# EAGLE design LCC OpenLCB BoosterPack Base (EAGLE 7.5.0)
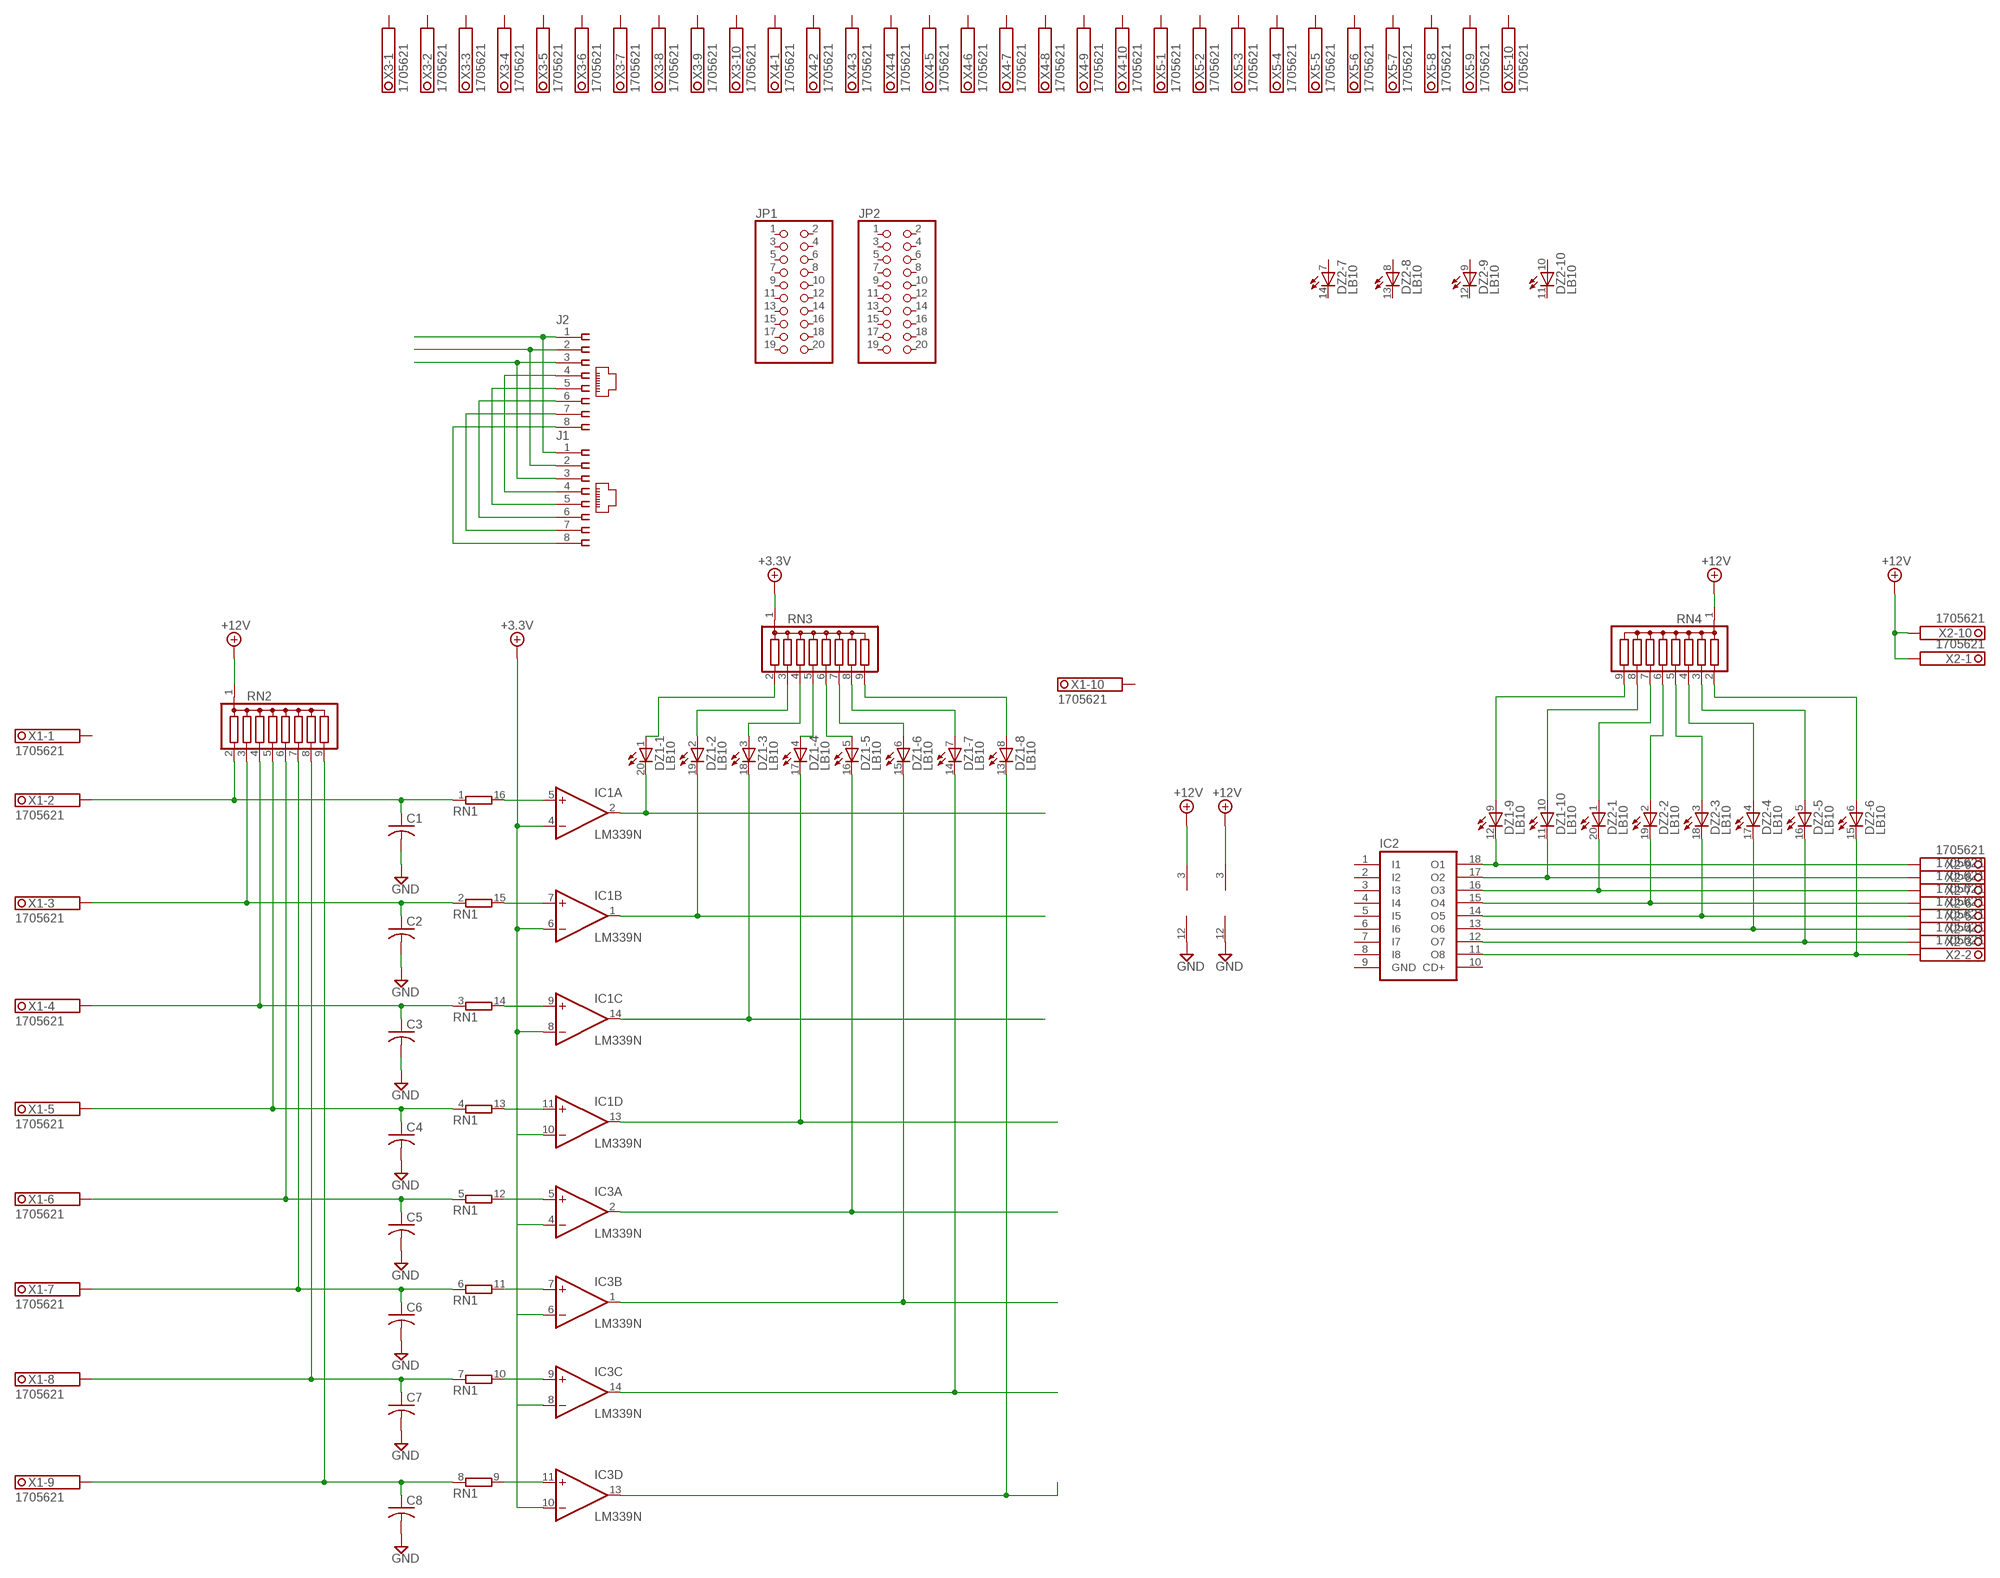
[diagram p0: schematic, sheet 1]

## Parts
C1  C-US075-032X103  [C075-032X103]
C2  C-US075-032X103  [C075-032X103]
C3  C-US075-032X103  [C075-032X103]
C4  C-US075-032X103  [C075-032X103]
C5  C-US075-032X103  [C075-032X103]
C6  C-US075-032X103  [C075-032X103]
C7  C-US075-032X103  [C075-032X103]
C8  C-US075-032X103  [C075-032X103]
DZ1  LB10  [LB10]
DZ2  LB10  [LB10]
IC1  LM339N  [DIL14]
IC2  ULN2803A  [DIL18]
IC3  LM339N  [DIL14]
J1  555164-1  [555164-1]
J2  555164-1  [555164-1]
JP1  PINHD-2X10  [2X10]
JP2  PINHD-2X10  [2X10]
RN1  8R-P  [DIL16]
RN2  G08R  [SIL9]
RN3  G08R  [SIL9]
RN4  G08R  [SIL9]
X1  1705621  [1705621]
X2  1705621  [1705621]
X3  1705621  [1705621]
X4  1705621  [1705621]
X5  1705621  [1705621]

## Nets
+3.3V: IC1.4(A:-IN) IC1.6(B:-IN) IC1.8(C:-IN) IC1.10(D:-IN) IC3.4(A:-IN) IC3.6(B:-IN) IC3.8(C:-IN) IC3.10(D:-IN) RN3.1
+12V: IC1.3(P:V+) IC3.3(P:V+) RN2.1 RN4.1 X2.1.1 X2.1.2 X2.10.1 X2.10.2
GND: C1.2 C2.2 C3.2 C4.2 C5.2 C6.2 C7.2 C8.2 IC1.12(P:GND) IC3.12(P:GND)
N$1: J1.1 J2.1
N$2: J1.2 J2.2
N$3: J1.3 J2.3
N$4: J1.4 J2.4
N$5: J1.5 J2.5
N$6: J1.6 J2.6
N$7: J1.7 J2.7
N$8: J1.8 J2.8
N$9: IC1.5(A:+IN) RN1.16
N$10: IC1.7(B:+IN) RN1.15
N$11: IC1.9(C:+IN) RN1.14
N$12: IC1.11(D:+IN) RN1.13
N$13: DZ1.1(-1:A) RN3.2
N$14: DZ1.2(-2:A) RN3.3
N$15: DZ1.3(-3:A) RN3.4
N$16: DZ1.4(-4:A) RN3.5
N$17: DZ1.5(-5:A) RN3.6
N$18: DZ1.6(-6:A) RN3.7
N$19: DZ1.7(-7:A) RN3.8
N$20: DZ1.8(-8:A) RN3.9
N$21: DZ1.20(-1:C) IC1.2(A:OUT)
N$22: DZ1.19(-2:C) IC1.1(B:OUT)
N$23: DZ1.18(-3:C) IC1.14(C:OUT)
N$24: DZ1.17(-4:C) IC1.13(D:OUT)
N$25: C1.1 RN1.1 RN2.2 X1.2.1 X1.2.2
N$26: C2.1 RN1.2 RN2.3 X1.3.1 X1.3.2
N$27: C3.1 RN1.3 RN2.4 X1.4.1 X1.4.2
N$28: C4.1 RN1.4 RN2.5 X1.5.1 X1.5.2
N$29: IC3.5(A:+IN) RN1.12
N$30: IC3.7(B:+IN) RN1.11
N$31: IC3.9(C:+IN) RN1.10
N$32: IC3.11(D:+IN) RN1.9
N$33: C5.1 RN1.5 RN2.6 X1.6.1 X1.6.2
N$34: C6.1 RN1.6 RN2.7 X1.7.1 X1.7.2
N$35: C7.1 RN1.7 RN2.8 X1.8.1 X1.8.2
N$36: C8.1 RN1.8 RN2.9 X1.9.1 X1.9.2
N$37: DZ1.16(-5:C) IC3.2(A:OUT)
N$38: DZ1.15(-6:C) IC3.1(B:OUT)
N$39: DZ1.14(-7:C) IC3.14(C:OUT)
N$40: DZ1.13(-8:C) IC3.13(D:OUT)
N$42: DZ1.12(-9:C) IC2.18(O1) X2.9.1 X2.9.2
N$43: DZ1.9(-9:A) RN4.9
N$44: DZ1.10(-10:A) RN4.8
N$45: DZ2.1(-1:A) RN4.7
N$46: DZ2.2(-2:A) RN4.6
N$47: DZ2.3(-3:A) RN4.5
N$48: DZ2.4(-4:A) RN4.4
N$49: DZ2.5(-5:A) RN4.3
N$50: DZ2.6(-6:A) RN4.2
N$51: DZ1.11(-10:C) IC2.17(O2) X2.8.1 X2.8.2
N$52: DZ2.20(-1:C) IC2.16(O3) X2.7.1 X2.7.2
N$53: DZ2.19(-2:C) IC2.15(O4) X2.6.1 X2.6.2
N$54: DZ2.18(-3:C) IC2.14(O5) X2.5.1 X2.5.2
N$55: DZ2.17(-4:C) IC2.13(O6) X2.4.1 X2.4.2
N$56: DZ2.16(-5:C) IC2.12(O7) X2.3.1 X2.3.2
N$57: DZ2.15(-6:C) IC2.11(O8) X2.2.1 X2.2.2
Unconnected: DZ2.7(-7:A) DZ2.8(-8:A) DZ2.9(-9:A) DZ2.10(-10:A) DZ2.11(-10:C) DZ2.12(-9:C) DZ2.13(-8:C) DZ2.14(-7:C) IC2.1(I1) IC2.2(I2) IC2.3(I3) IC2.4(I4) IC2.5(I5) IC2.6(I6) IC2.7(I7) IC2.8(I8) IC2.10(CD+) JP1.1 JP1.2 JP1.3 JP1.4 JP1.5 JP1.6 JP1.7 JP1.8 JP1.9 JP1.10 JP1.11 JP1.12 JP1.13 JP1.14 JP1.15 JP1.16 JP1.17 JP1.18 JP1.19 JP1.20 JP2.1 JP2.2 JP2.3 JP2.4 JP2.5 JP2.6 JP2.7 JP2.8 JP2.9 JP2.10 JP2.11 JP2.12 JP2.13 JP2.14 JP2.15 JP2.16 JP2.17 JP2.18 JP2.19 JP2.20 X1.1.1 X1.1.2 X1.10.1 X1.10.2 X3.1.1 X3.1.2 X3.2.1 X3.2.2 X3.3.1 X3.3.2 X3.4.1 X3.4.2 X3.5.1 X3.5.2 X3.6.1 X3.6.2 X3.7.1 X3.7.2 X3.8.1 X3.8.2 X3.9.1 X3.9.2 X3.10.1 X3.10.2 X4.1.1 X4.1.2 X4.2.1 X4.2.2 X4.3.1 X4.3.2 X4.4.1 X4.4.2 X4.5.1 X4.5.2 X4.6.1 X4.6.2 X4.7.1 X4.7.2 X4.8.1 X4.8.2 X4.9.1 X4.9.2 X4.10.1 X4.10.2 X5.1.1 X5.1.2 X5.2.1 X5.2.2 X5.3.1 X5.3.2 X5.4.1 X5.4.2 X5.5.1 X5.5.2 X5.6.1 X5.6.2 X5.7.1 X5.7.2 X5.8.1 X5.8.2 X5.9.1 X5.9.2 X5.10.1 X5.10.2

## Power pins joined to a net without a drawn wire
GND: IC2.9(GND)

## Library data of the parts
C1-C8 = rcl:C-US: CAPACITOR, American symbol
DZ1 DZ2 = led:LB10: LED BLOCK 10-LED bar graph, DIL, Siemens
IC1 IC3 = linear:LM339: Low Power Low Offset Voltage Quad Comparators with open collector; LM139/LM239/LM339/LM2901/LM3302
IC2 = uln-udn:ULN2803A: DRIVER ARRAY
J1 J2 = con-amp:555164-1: AMP connector
JP1 JP2 = pinhead:PINHD-2X10: PIN HEADER
RN1 = resistor-dil:8R-P: DIL RESISTOR; OC_FARNELL: unknown; OC_NEWARK: unknown
RN2-RN4 = resistor-sil:G08R: SIL RESISTOR; OC_FARNELL: unknown; OC_NEWARK: unknown
X1-X5 = con-phoenix-3.81:1705621: MKDSD 1,5/10-3,81 Printklemme Nennstrom: 8 A Bemessungsspannung: 200 V Raster: 3,81 mm Polzahl: 12 Montageart: Löten Anschlussart: Schraubanschluss Anschlussrichtung vom Leiter zur Platine: 0° Source: http://eshop.phoenixcontact.com .. 1705621.pdf; OC_FARNELL: unknown; OC_NEWARK: unknown

## Board
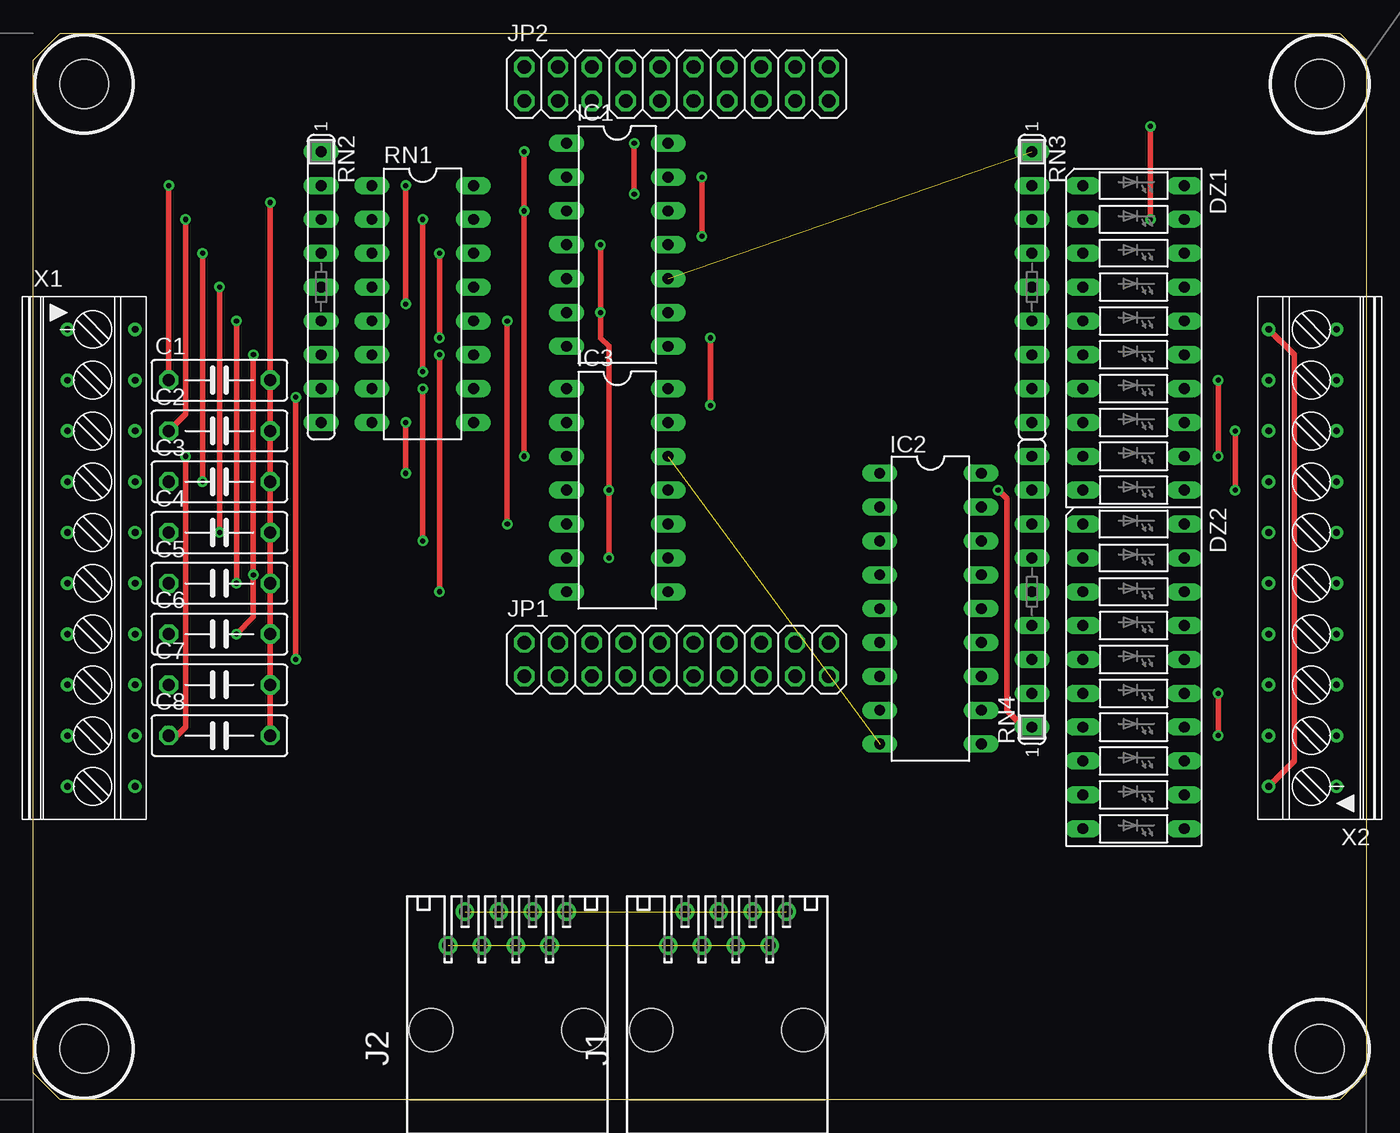
[diagram p1: board, top side]
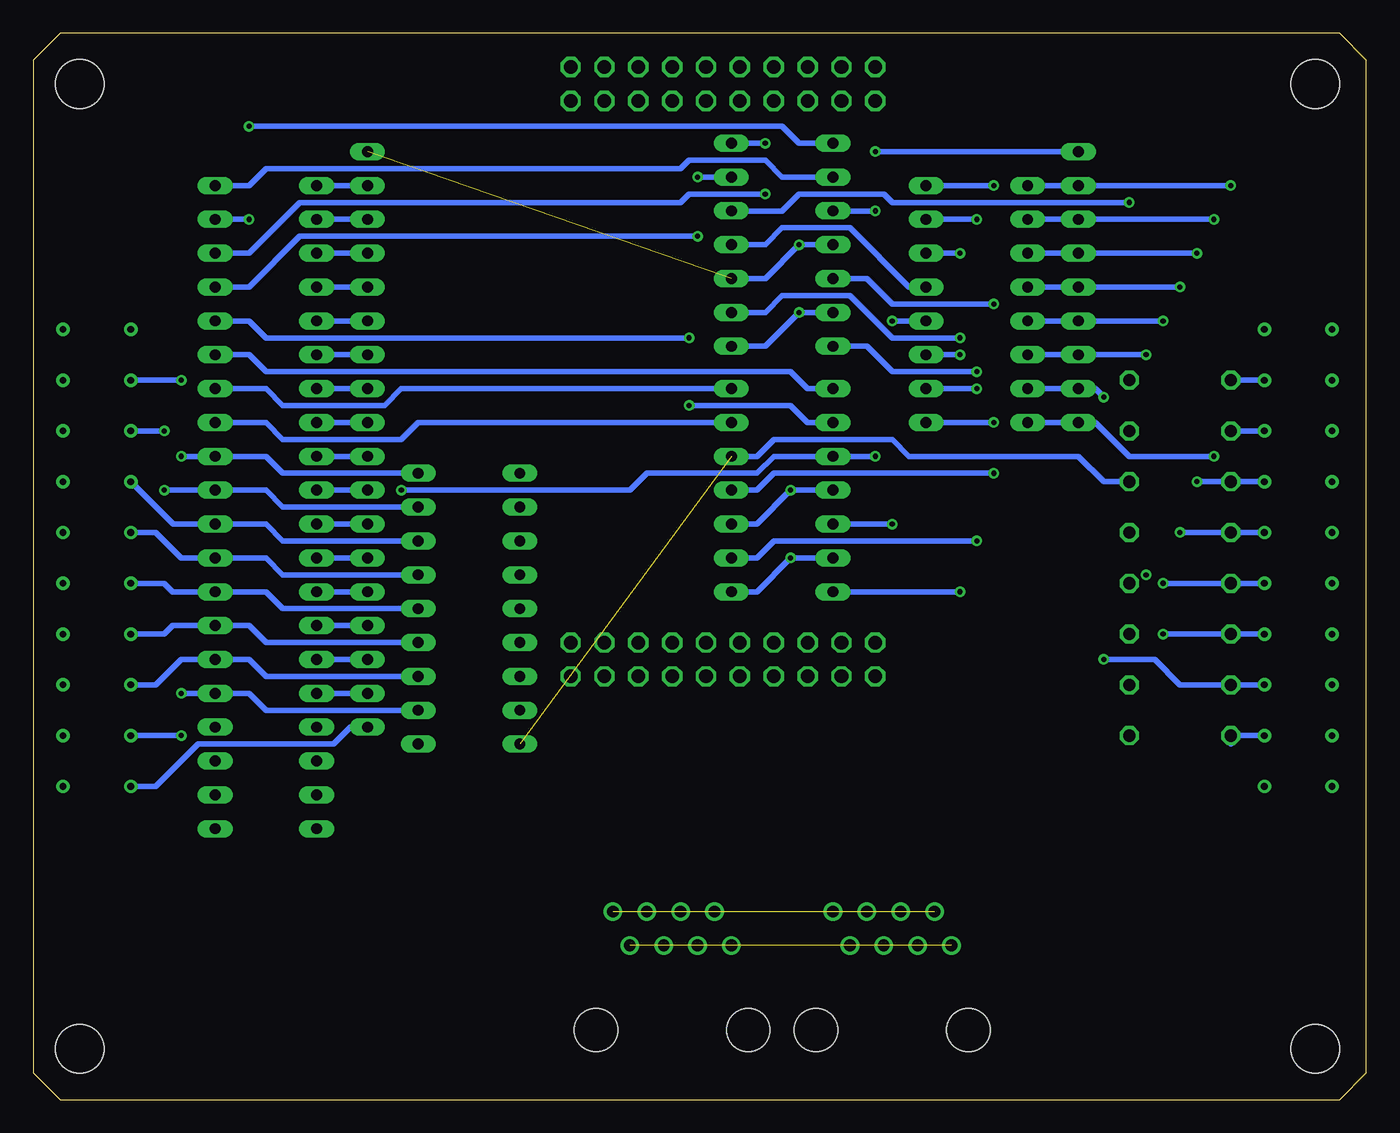
[diagram p2: board, bottom side, seen from below]

Size 100 x 80 mm. Coordinates in mm from the lower left corner, seen from the top.
Outline: 98,0 2,0 0,2 0,78 2,80 98,80 100,78 100,2 98,0
Copper layers (1*16): Top 0.035mm / dielectric 1.5mm / Bottom 0.035mm
Design rules "default": minimum track width 10mil, minimum drill 24mil, track to track 8mil, track to pad 8mil, pad to pad 8mil, via to via 8mil, smd to smd 8mil, copper to edge 40mil, drill to drill 8mil, minimum pad ring 10mil, minimum via ring 8mil, stop-mask expansion 4mil, vias tented up to drill 0mil, thermal gap 10mil
Holes 3.66 mm at 3.81,76.2 96.52,76.2 96.52,3.81 3.81,3.81 3.81,76.2
tKeepout: area 0.4,72.8 to 7.2,79.6; area 93.1,72.8 to 99.9,79.6; area 93.1,0.4 to 99.9,7.2; area 0.4,0.4 to 7.2,7.2
bKeepout: area 0.4,72.8 to 7.2,79.6; area 93.1,72.8 to 99.9,79.6; area 93.1,0.4 to 99.9,7.2; area 0.4,0.4 to 7.2,7.2

### Footprints (pad centres in the part's own frame; a part is rotated, then mirrored left to right if it is on the bottom)
C075-032X103 = drill 0.914 octagon: 1 -3.81,0; 2 3.81,0
LB10 = drill 0.813 long: 1 -11.43,-3.81; 2 -8.89,-3.81; 3 -6.35,-3.81; 4 -3.81,-3.81; 5 -1.27,-3.81; 6 1.27,-3.81; 7 3.81,-3.81; 8 6.35,-3.81; 9 8.89,-3.81; 10 11.43,-3.81; 11 11.43,3.81; 12 8.89,3.81; 13 6.35,3.81; 14 3.81,3.81; 15 1.27,3.81; 16 -1.27,3.81; 17 -3.81,3.81; 18 -6.35,3.81; 19 -8.89,3.81; 20 -11.43,3.81
DIL14 = drill 0.813 long: 1 -7.62,-3.81; 2 -5.08,-3.81; 3 -2.54,-3.81; 4 0,-3.81; 5 2.54,-3.81; 6 5.08,-3.81; 7 7.62,-3.81; 8 7.62,3.81; 9 5.08,3.81; 10 2.54,3.81; 11 0,3.81; 12 -2.54,3.81; 13 -5.08,3.81; 14 -7.62,3.81
DIL18 = drill 0.813 long: 1 -10.16,-3.81; 2 -7.62,-3.81; 3 -5.08,-3.81; 4 -2.54,-3.81; 5 0,-3.81; 6 2.54,-3.81; 7 5.08,-3.81; 8 7.62,-3.81; 9 10.16,-3.81; 10 10.16,3.81; 11 7.62,3.81; 12 5.08,3.81; 13 2.54,3.81; 14 0,3.81; 15 -2.54,3.81; 16 -5.08,3.81; 17 -7.62,3.81; 18 -10.16,3.81
555164-1 = drill 0.889: 1 -4.445,5.207; 2 -3.175,7.747; 3 -1.905,5.207; 4 -0.635,7.747; 5 0.635,5.207; 6 1.905,7.747; 7 3.175,5.207; 8 4.445,7.747 | hole 3.251: -5.715,-1.143; 5.715,-1.143
2X10 = drill 1.016 octagon: 1 -11.43,-1.27; 2 -11.43,1.27; 3 -8.89,-1.27; 4 -8.89,1.27; 5 -6.35,-1.27; 6 -6.35,1.27; 7 -3.81,-1.27; 8 -3.81,1.27; 9 -1.27,-1.27; 10 -1.27,1.27; 11 1.27,-1.27; 12 1.27,1.27; 13 3.81,-1.27; 14 3.81,1.27; 15 6.35,-1.27; 16 6.35,1.27; 17 8.89,-1.27; 18 8.89,1.27; 19 11.43,-1.27; 20 11.43,1.27
DIL16 = drill 0.813 long: 1 -8.89,-3.81; 2 -6.35,-3.81; 3 -3.81,-3.81; 4 -1.27,-3.81; 5 1.27,-3.81; 6 3.81,-3.81; 7 6.35,-3.81; 8 8.89,-3.81; 9 8.89,3.81; 10 6.35,3.81; 11 3.81,3.81; 12 1.27,3.81; 13 -1.27,3.81; 14 -3.81,3.81; 15 -6.35,3.81; 16 -8.89,3.81
SIL9 = drill 0.813 long: 1 -10.16,0; 2 -7.62,0; 3 -5.08,0; 4 -2.54,0; 5 0,0; 6 2.54,0; 7 5.08,0; 8 7.62,0; 9 10.16,0
1705621 = drill 0.5 pad 0.9: 1.1 -17.145,-1.25; 1.2 -17.145,3.83; 2.1 -13.335,-1.25; 2.2 -13.335,3.83; 3.1 -9.525,-1.25; 3.2 -9.525,3.83; 4.1 -5.715,-1.25; 4.2 -5.715,3.83; 5.1 -1.905,-1.25; 5.2 -1.905,3.83; 6.1 1.905,-1.25; 6.2 1.905,3.83; 7.1 5.715,-1.25; 7.2 5.715,3.83; 8.1 9.525,-1.25; 8.2 9.525,3.83; 9.1 13.335,-1.25; 9.2 13.335,3.83; 10.1 17.145,-1.25; 10.2 17.145,3.83

### Placement (x,y rotation side)
C1  13.97,53.98 0 top
C2  13.97,50.16 0 top
C3  13.97,46.35 0 top
C4  13.97,42.55 0 top
C5  13.97,38.73 0 top
C6  13.97,34.92 0 top
C7  13.97,31.11 0 top
C8  13.97,27.3 0 top
DZ1  82.55,57.15 270 top
DZ2  82.55,31.75 270 top
IC1  43.81,64.14 270 top
IC2  67.31,36.83 270 top
IC3  43.81,45.72 270 top
J1  52.07,6.35 0 top
J2  35.56,6.35 0 top
JP1  48.26,33.02 0 top
JP2  48.26,76.2 0 top
RN1  29.21,59.69 270 top
RN2  21.59,60.96 270 top
RN3  74.93,60.96 270 top
RN4  74.93,38.1 90 top
X1  3.81,40.64 270 top
X2  96.52,40.64 90 top
X3  170.18,27.94 90 top  (outside the outline)
X4  158.75,27.94 90 top  (outside the outline)
X5  147.32,27.94 90 top  (outside the outline)

### Tracks (layer width: path | path; a pad name or v marks a point on that pad's centre or on a via)
+3.3V  (via drill 0.38)  (1 unrouted)
  Top 0.406: v42.55,64.14 v42.55,59.05 42.55,57.15 43.18,56.52 v43.18,45.72 v43.18,40.64
  Bottom 0.406: IC1.4 v42.55,64.14 45.09,61.59 IC1.10 | IC1.8 45.09,56.52 v42.55,59.05 IC1.6 | IC3.8 45.72,38.1 v43.18,40.64 IC3.6 | IC3.10 45.72,43.18 v43.18,45.72 IC3.4
+12V  (via drill 0.38)  (1 unrouted)
  Top 0.406: X2.10.2 92.71,57.78 94.61,55.88 94.61,25.42 X2.1.2 | v36.83,71.12 v36.83,66.67 v36.83,48.26 | RN4.1 74.3,27.94 73.03,29.21 73.03,45.09 v72.39,45.72
  Bottom 0.406: X2.1.2 90.81,23.5 87.63,26.67 77.47,26.67 76.2,27.94 RN4.1 | RN2.1 v36.83,71.12 | v36.83,48.26 IC3.3 44.45,48.26 45.72,46.99 53.98,46.99 55.24,45.72 v72.39,45.72 | IC1.3 v36.83,66.67
GND  (via drill 0.38)  (1 unrouted)
  Top 0.406: v17.78,67.31 C1.2 C2.2 C3.2 C4.2 C5.2 C6.2 C7.2 C8.2
  Bottom 0.406: IC1.12 43.81,66.67 42.55,67.94 36.2,67.94 35.56,67.31 v17.78,67.31 | IC3.12 45.72,48.26 44.45,49.53 35.56,49.53 34.29,48.26 21.59,48.26 19.68,46.35 C3.2
N$1  (1 unrouted)
N$2  (1 unrouted)
N$3  (1 unrouted)
N$4  (1 unrouted)
N$5  (1 unrouted)
N$6  (1 unrouted)
N$7  (1 unrouted)
N$8  (1 unrouted)
N$9  (via drill 0.38)
  Top 0.406: v27.94,68.58 v27.94,59.69
  Bottom 0.406: RN1.16 v27.94,68.58 | v27.94,59.69 35.56,59.69 37.47,61.59 IC1.5
N$10  (via drill 0.38)
  Top 0.406: v29.21,66.04 v29.21,54.61
  Bottom 0.406: RN1.15 v29.21,66.04 | v29.21,54.61 35.56,54.61 37.47,56.52 IC1.7
N$11  (via drill 0.38)
  Top 0.406: v30.48,63.5 v30.48,57.15
  Bottom 0.406: RN1.14 v30.48,63.5 | v30.48,57.15 35.56,57.15 38.73,60.33 43.81,60.33 45.09,59.05 IC1.9
N$12
  Bottom 0.406: RN1.13 34.29,60.96 38.73,65.41 43.81,65.41 45.09,64.14 IC1.11
N$13
  Bottom 0.406: RN3.2 DZ1.1
N$14
  Bottom 0.406: RN3.3 DZ1.2
N$15
  Bottom 0.406: RN3.4 DZ1.3
N$16
  Bottom 0.406: RN3.5 DZ1.4
N$17
  Bottom 0.406: RN3.6 DZ1.5
N$18
  Bottom 0.406: RN3.7 DZ1.6
N$19
  Bottom 0.406: RN3.8 DZ1.7
N$20
  Bottom 0.406: RN3.9 DZ1.8
N$21
  Bottom 0.406: IC1.2 43.81,69.22 45.09,70.48 50.8,70.48 51.44,69.85 82.55,69.85 83.82,68.58 DZ1.20
N$22  (via drill 0.38)
  Top 0.406: v83.82,73.03 v83.82,66.04
  Bottom 0.406: IC1.1 42.55,71.75 43.81,73.03 v83.82,73.03 | v83.82,66.04 DZ1.19
N$23  (via drill 0.38)
  Top 0.406: v45.09,71.75 v45.09,67.94
  Bottom 0.406: IC1.14 v45.09,71.75 | v45.09,67.94 50.8,67.94 51.44,67.31 80.01,67.31 83.82,63.5 DZ1.18
N$24  (via drill 0.38)
  Top 0.406: v50.16,69.22 v50.16,64.77
  Bottom 0.406: IC1.13 v50.16,69.22 | v50.16,64.77 80.01,64.77 83.82,60.96 DZ1.17
N$25  (via drill 0.38)
  Top 0.406: C1.1 v10.16,68.58
  Bottom 0.406: X1.2.2 C1.1 | RN1.1 RN2.2 v10.16,68.58
N$26  (via drill 0.38)
  Top 0.406: C2.1 11.43,51.44 v11.43,66.04
  Bottom 0.406: X1.3.2 C2.1 | RN1.2 RN2.3 v11.43,66.04
N$27  (via drill 0.38)
  Top 0.406: v12.7,46.35 v12.7,63.5
  Bottom 0.406: X1.4.2 C3.1 v12.7,46.35 | RN1.3 RN2.4 v12.7,63.5
N$28  (via drill 0.38)
  Top 0.406: v13.97,42.55 v13.97,60.96
  Bottom 0.406: X1.5.2 C4.1 v13.97,42.55 | RN1.4 RN2.5 v13.97,60.96
N$29  (via drill 0.38)
  Top 0.406: v35.56,58.42 v35.56,43.18
  Bottom 0.406: RN1.12 v35.56,58.42 | v35.56,43.18 IC3.5
N$30  (via drill 0.38)
  Top 0.406: v30.48,55.88 v30.48,38.1
  Bottom 0.406: RN1.11 v30.48,55.88 | v30.48,38.1 IC3.7
N$31  (via drill 0.38)
  Top 0.406: v29.21,53.34 v29.21,41.91
  Bottom 0.406: RN1.10 v29.21,53.34 | v29.21,41.91 44.45,41.91 45.72,40.64 IC3.9
N$32  (via drill 0.38)
  Top 0.406: v27.94,50.8 v27.94,46.99
  Bottom 0.406: RN1.9 v27.94,50.8 | v27.94,46.99 44.45,46.99 45.72,45.72 IC3.11
N$33  (via drill 0.38)
  Top 0.406: v15.24,58.42 v15.24,38.73
  Bottom 0.406: X1.6.2 C5.1 v15.24,38.73 | RN1.5 RN2.6 v15.24,58.42
N$34  (via drill 0.38)
  Top 0.406: v16.51,55.88 16.51,36.2 v15.24,34.92
  Bottom 0.406: X1.7.2 C6.1 v15.24,34.92 | RN1.6 RN2.7 v16.51,55.88
N$35  (via drill 0.38)
  Top 0.406: v19.68,52.7 v19.68,33.02
  Bottom 0.406: X1.8.2 C7.1 13.97,31.11 15.88,33.02 v19.68,33.02 | RN1.7 RN2.8 20.32,53.34 v19.68,52.7
N$36  (via drill 0.38)
  Top 0.406: C8.1 10.79,27.3 11.43,27.94 v11.43,48.26
  Bottom 0.406: X1.9.2 9.53,27.3 10.16,26.67 C8.1 | RN1.8 RN2.9 20.32,50.8 17.78,48.26 v11.43,48.26
N$37  (via drill 0.38)
  Top 0.406: v50.8,52.07 v50.8,57.15
  Bottom 0.406: IC3.2 41.91,50.8 43.18,52.07 v50.8,52.07 | v50.8,57.15 82.55,57.15 83.82,58.42 DZ1.16
N$38
  Bottom 0.406: IC3.1 41.91,53.34 43.18,54.61 82.55,54.61 83.82,55.88 DZ1.15
N$39
  Bottom 0.406: IC3.14 72.39,53.34 73.66,52.07 81.28,52.07 82.55,53.34 DZ1.14
N$40
  Bottom 0.406: IC3.13 71.12,50.8 72.39,49.53 81.28,49.53 82.55,50.8 DZ1.13
N$41  (via drill 0.38)
  other vias: 16.51,39.37
N$42  (via drill 0.38)
  Top 0.406: v88.9,48.26 v88.9,53.98
  Bottom 0.406: IC2.18 81.28,46.99 82.55,48.26 DZ1.12 v88.9,48.26 | v88.9,53.98 X2.9.2
N$43
  Bottom 0.406: RN4.9 DZ1.9
N$44
  Bottom 0.406: RN4.8 DZ1.10
N$45
  Bottom 0.406: RN4.7 DZ2.1
N$46
  Bottom 0.406: RN4.6 DZ2.2
N$47
  Bottom 0.406: DZ2.3 RN4.5
N$48
  Bottom 0.406: RN4.4 DZ2.4
N$49
  Bottom 0.406: DZ2.5 RN4.3
N$50
  Bottom 0.406: RN4.2 DZ2.6
N$51  (via drill 0.38)
  Top 0.406: v90.17,45.72 v90.17,50.16
  Bottom 0.406: IC2.17 81.28,44.45 82.55,45.72 DZ1.11 v90.17,45.72 | v90.17,50.16 X2.8.2
N$52
  Bottom 0.406: IC2.16 81.28,41.91 82.55,43.18 DZ2.20 89.52,43.18 X2.7.2
N$53
  Bottom 0.406: IC2.15 81.28,39.37 82.55,40.64 DZ2.19 88.9,40.64 90.81,42.55 X2.6.2
N$54
  Bottom 0.406: IC2.14 81.28,36.83 82.55,38.1 DZ2.18 89.53,38.1 90.17,38.73 X2.5.2
N$55
  Bottom 0.406: IC2.13 82.55,34.29 83.82,35.56 DZ2.17 89.53,35.56 90.17,34.92 X2.4.2
N$56
  Bottom 0.406: IC2.12 82.55,31.75 83.82,33.02 DZ2.16 88.9,33.02 90.81,31.11 X2.3.2
N$57  (via drill 0.38)
  Top 0.406: v88.9,30.48 v88.9,27.3
  Bottom 0.406: IC2.11 82.55,29.21 83.82,30.48 DZ2.15 v88.9,30.48 | v88.9,27.3 X2.2.2

### Text on the board
tDocu: 6-32 OR M3.5 x .6 / MOUNTING HOLE / (TYP. 4)
Tiva: Tiva Lauchpad Outline